# EAGLE design Carrier Board (EAGLE 8.2.2)

## Sheet 1 of 3: Sensors
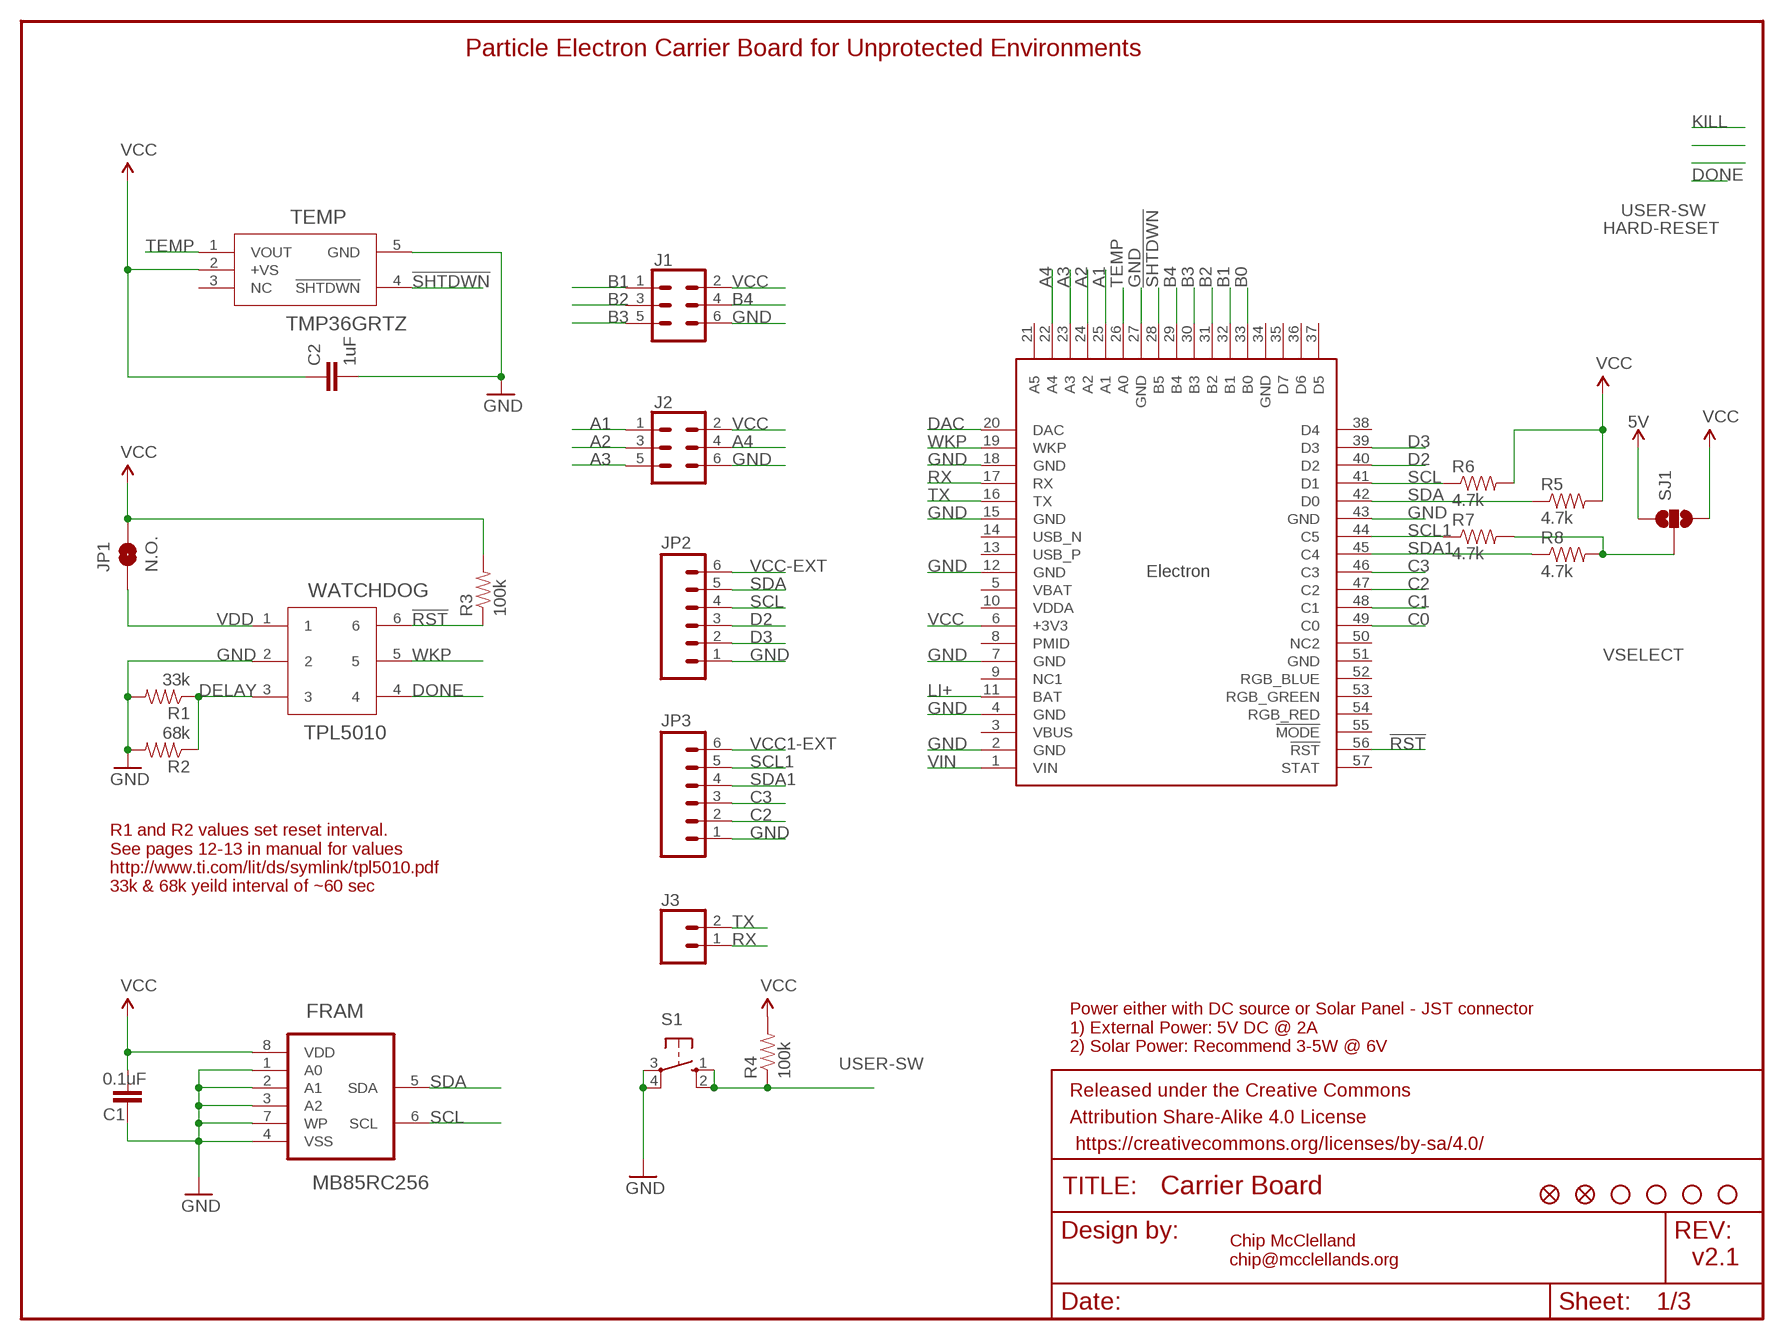
[diagram p0: schematic, sheet 1]

### Parts
C1  0.1uF  CAP0805  [0805]
C2  1uF  CAP0805  [0805]
FD1  FIDUCIALUFIDUCIAL  [FIDUCIAL-MICRO]
FD2  FIDUCIALUFIDUCIAL  [FIDUCIAL-MICRO]
FRAM  MB85RC256  MB85RC128PNF-G-JNE1  [SOIC127P600X175-8N]
FRAME1  FRAME-LETTER  [CREATIVE_COMMONS]
J1  CONN_03X22X3_SILK_MALE_PTH  [2X3]
J2  CONN_03X22X3_SILK_MALE_PTH  [2X3]
J3  CONN_02  [1X02]
JP1  N.O.  JUMPER-SMT_2_NO_SILK  [SMT-JUMPER_2_NO_SILK]
JP2  M06LOCK  [1X06_LOCK]
JP3  M06LOCK  [1X06_LOCK]
JP4  STAND-OFF  [STAND-OFF]
JP5  STAND-OFF  [STAND-OFF]
JP6  STAND-OFF  [STAND-OFF]
JP7  STAND-OFF  [STAND-OFF]
R1  33k  RESISTOR0805-RES  [0805]
R2  68k  RESISTOR0805-RES  [0805]
R3  100k  RESISTOR0805-RES  [0805]
R4  100k  RESISTOR0805-RES  [0805]
R5  4.7k  RESISTOR0805-RES  [0805]
R6  4.7k  RESISTOR0805-RES  [0805]
R7  4.7k  RESISTOR0805-RES  [0805]
R8  4.7k  RESISTOR0805-RES  [0805]
S1  10-XX  [B3F-10XX]
SJ1  SOLDERJUMPER_2WAYPASTE1&2  [SJ_3_PASTE1&2]
TEMP  TMP36GRTZ  TMP36GRTZ-REEL7  [RJ_5]
U$1  E0-NOT-OFFICIAL  [E0-NOT-OFFICIAL]
WATCHDOG  TPL5010  [TSOT-23]

### Nets
5V: SJ1.1 ; also sheet 3
!RST: R3.1 U$1.56(!RST) WATCHDOG.6
!SHTDWN: TEMP.4(!SHTDWN) U$1.28(B5)
A1: J2.1 U$1.25(A1)
A2: J2.3 U$1.24(A2)
A3: J2.5 U$1.23(A3)
A4: J2.4 U$1.22(A4)
B0: U$1.33(B0)
B1: J1.1 U$1.32(B1)
B2: J1.3 U$1.31(B2)
B3: J1.5 U$1.30(B3)
B4: J1.4 U$1.29(B4)
C0: U$1.49(C0)
C1: U$1.48(C1)
C2: JP3.2 U$1.47(C2) ; also sheet 3
C3: JP3.3 U$1.46(C3) ; also sheet 3
D2: JP2.3 U$1.40(D2) ; also sheet 3
D3: JP2.2 U$1.39(D3) ; also sheet 3
DAC: U$1.20(DAC)
DELAY: R1.1 R2.1 WATCHDOG.3
DONE: WATCHDOG.4
GND: C1.2 C2.2 FRAM.1(A0) FRAM.2(A1) FRAM.3(A2) FRAM.4(VSS) FRAM.7(WP) J1.6 J2.6 JP2.1 JP3.1 R1.2 R2.2 S1.3(P) S1.4(P1) TEMP.5(GND) U$1.7(GND) U$1.18(GND) U$1.27(GND) U$1.43(GND) WATCHDOG.2 ; also sheet 2,3
LI+: U$1.11(BAT) ; also sheet 2
RX: J3.1 U$1.17(RX)
SCL: FRAM.6(SCL) JP2.4 R6.1 U$1.41(D1) ; also sheet 3
SCL1: JP3.5 R7.1 U$1.44(C5) ; also sheet 3
SDA: FRAM.5(SDA) JP2.5 R5.1 U$1.42(D0) ; also sheet 3
SDA1: JP3.4 R8.1 U$1.45(C4) ; also sheet 3
TEMP: TEMP.1(VOUT) U$1.26(A0)
TX: J3.2 U$1.16(TX)
USER-SW: R4.1 S1.1(S) S1.2(S1)
VCC: C1.1 C2.1 FRAM.8(VDD) J1.2 J2.2 JP1.2 R3.2 R4.2 R5.2 R6.2 SJ1.3 TEMP.2(+VS) U$1.6(+3V3) ; also sheet 3
VCC1-EXT: JP3.6 ; also sheet 3
VCC-EXT: JP2.6 ; also sheet 3
VDD: JP1.1 WATCHDOG.1
VIN: U$1.1(VIN) ; also sheet 2
VSELECT: R7.2 R8.2 SJ1.2 ; also sheet 3
WKP: U$1.19(WKP) WATCHDOG.5
Unconnected: TEMP.3(NC) U$1.2(GND) U$1.3(VBUS) U$1.4(GND) U$1.5(VBAT) U$1.8(PMID) U$1.9(NC1) U$1.10(VDDA) U$1.12(GND) U$1.13(USB_P) U$1.14(USB_N) U$1.15(GND) U$1.21(A5) U$1.34(GND) U$1.35(D7) U$1.36(D6) U$1.37(D5) U$1.38(D4) U$1.50(NC2) U$1.51(GND) U$1.52(RGB_BLUE) U$1.53(RGB_GREEN) U$1.54(RGB_RED) U$1.55(!MODE) U$1.57(STAT)

### Notes on the sheet
- Particle Electron Carrier Board for Unprotected Environments
- R1 and R2 values set reset interval.
  See pages 12-13 in manual for values
  http://www.ti.com/lit/ds/symlink/tpl5010.pdf
  33k & 68k yeild interval of ~60 sec
- Power either with DC source or Solar Panel - JST connector
  1) External Power: 5V DC @ 2A 
  2) Solar Power: Recommend 3-5W @ 6V
- Chip McClelland
  chip@mcclellands.org
- v2.1

## Sheet 2 of 3: Power Control
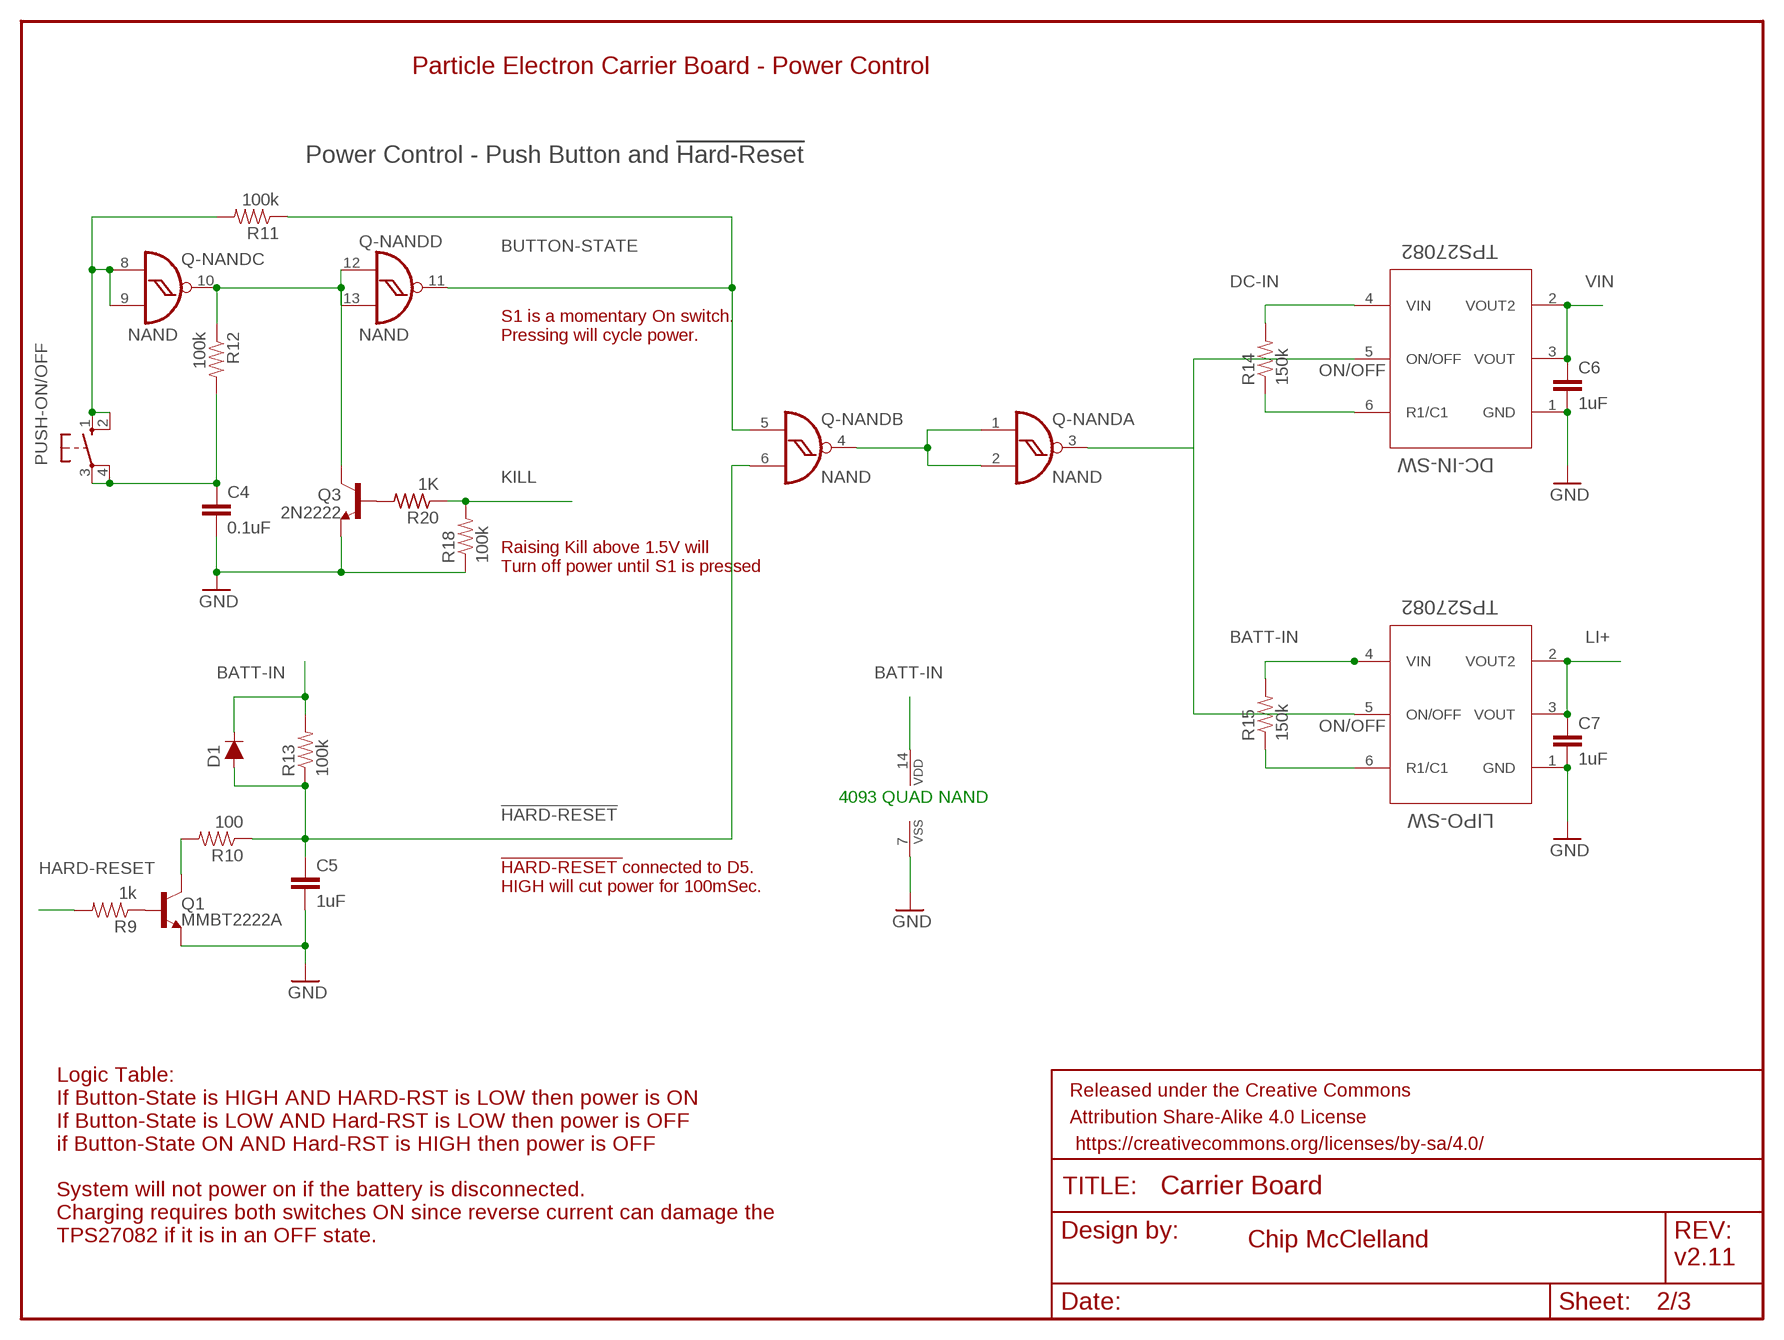
[diagram p1: schematic, sheet 2]

### Parts
C4  0.1uF  CAP0805  [0805]
C5  1uF  CAP0805  [0805]
C6  1uF  CAP0805  [0805]
C7  1uF  CAP0805  [0805]
D1  DIODE-BAS16J  [SOD-323]
DC-IN-SW  TPS27082  [TSOT-23]
FRAME2  FRAME-LETTER  [CREATIVE_COMMONS]
LIPO-SW  TPS27082  [TSOT-23]
PUSH-ON/OFF  40-XX-ROUND  [B3F-40XX-ROUND]
Q1  MMBT2222A  TRANS_NPN-MMBT2222AL  [SOT23-3]
Q3  2N2222  MMBT2222ALT1-NPN-SOT23-BEC  [SOT23-BEC]
Q-NAND  NAND  4093DT  [MC14093B-TSSOP14]
R9  1k  RESISTOR0805-RES  [0805]
R10  100  RESISTOR0805-RES  [0805]
R11  100k  RESISTOR0805-RES  [0805]
R12  100k  RESISTOR0805-RES  [0805]
R13  100k  RESISTOR0805-RES  [0805]
R14  150k  RESISTOR0805-RES  [0805]
R15  150k  RESISTOR0805-RES  [0805]
R18  100k  RESISTOR0805-RES  [0805]
R20  1K  R-US_R0805  [R0805]

### Nets
!HARD-RESET: C5.1 D1.A Q-NAND.6(B:I1) R10.1 R13.1
BATT-IN: D1.C LIPO-SW.4(VIN) Q-NAND.14(P:VDD) R13.2 R15.2 ; also sheet 3
BUTTON-STATE: Q-NAND.5(B:I0) Q-NAND.11(D:O) R11.1
DC-IN: DC-IN-SW.4(VIN) R14.2 ; also sheet 3
GND: C4.2 C5.2 C6.2 C7.2 DC-IN-SW.1(GND) LIPO-SW.1(GND) Q1.2(E) Q3.E Q-NAND.7(P:VSS) R18.1 ; also sheet 1,3
HARD-RESET: R9.2 ; also sheet 1
KILL: R18.2 R20.1 ; also sheet 1
LI+: C7.1 LIPO-SW.2(VOUT2) LIPO-SW.3(VOUT) ; also sheet 1
N$1: Q-NAND.1(A:I0) Q-NAND.2(A:I1) Q-NAND.4(B:O)
N$8: Q3.B R20.2
N$14: Q3.C Q-NAND.10(C:O) Q-NAND.12(D:I0) Q-NAND.13(D:I1) R12.1
N$15: DC-IN-SW.6(R1/C1) R14.1
N$16: Q1.1(B) R9.1
N$17: LIPO-SW.6(R1/C1) R15.1
N$19: Q1.3(C) R10.2
N$24: C4.1 PUSH-ON/OFF.3(P) PUSH-ON/OFF.4(P1) R12.2
N$25: PUSH-ON/OFF.1(S) PUSH-ON/OFF.2(S1) Q-NAND.8(C:I0) Q-NAND.9(C:I1) R11.2
ON/OFF: DC-IN-SW.5(ON/OFF) LIPO-SW.5(ON/OFF) Q-NAND.3(A:O)
VIN: C6.1 DC-IN-SW.2(VOUT2) DC-IN-SW.3(VOUT) ; also sheet 1

### Notes on the sheet
- Particle Electron Carrier Board - Power Control
- Power Control - Push Button and !Hard-Reset
- S1 is a momentary On switch.
  Pressing will cycle power.
- Raising Kill above 1.5V will
  Turn off power until S1 is pressed
- 4093 QUAD NAND
- !HARD-RESET !connected to D5. 
  HIGH will cut power for 100mSec.
- Chip McClelland
- Logic Table:
  If Button-State is HIGH AND HARD-RST is LOW then power is ON
  If Button-State is LOW AND Hard-RST is LOW then power is OFF
  if Button-State ON AND Hard-RST is HIGH then power is OFF
  
  System will not power on if the battery is disconnected.  
  Charging requires both switches ON since reverse current can damage the
  TPS27082 if it is in an OFF state.
- v2.11

## Sheet 3 of 3: Protection and 5V Boost
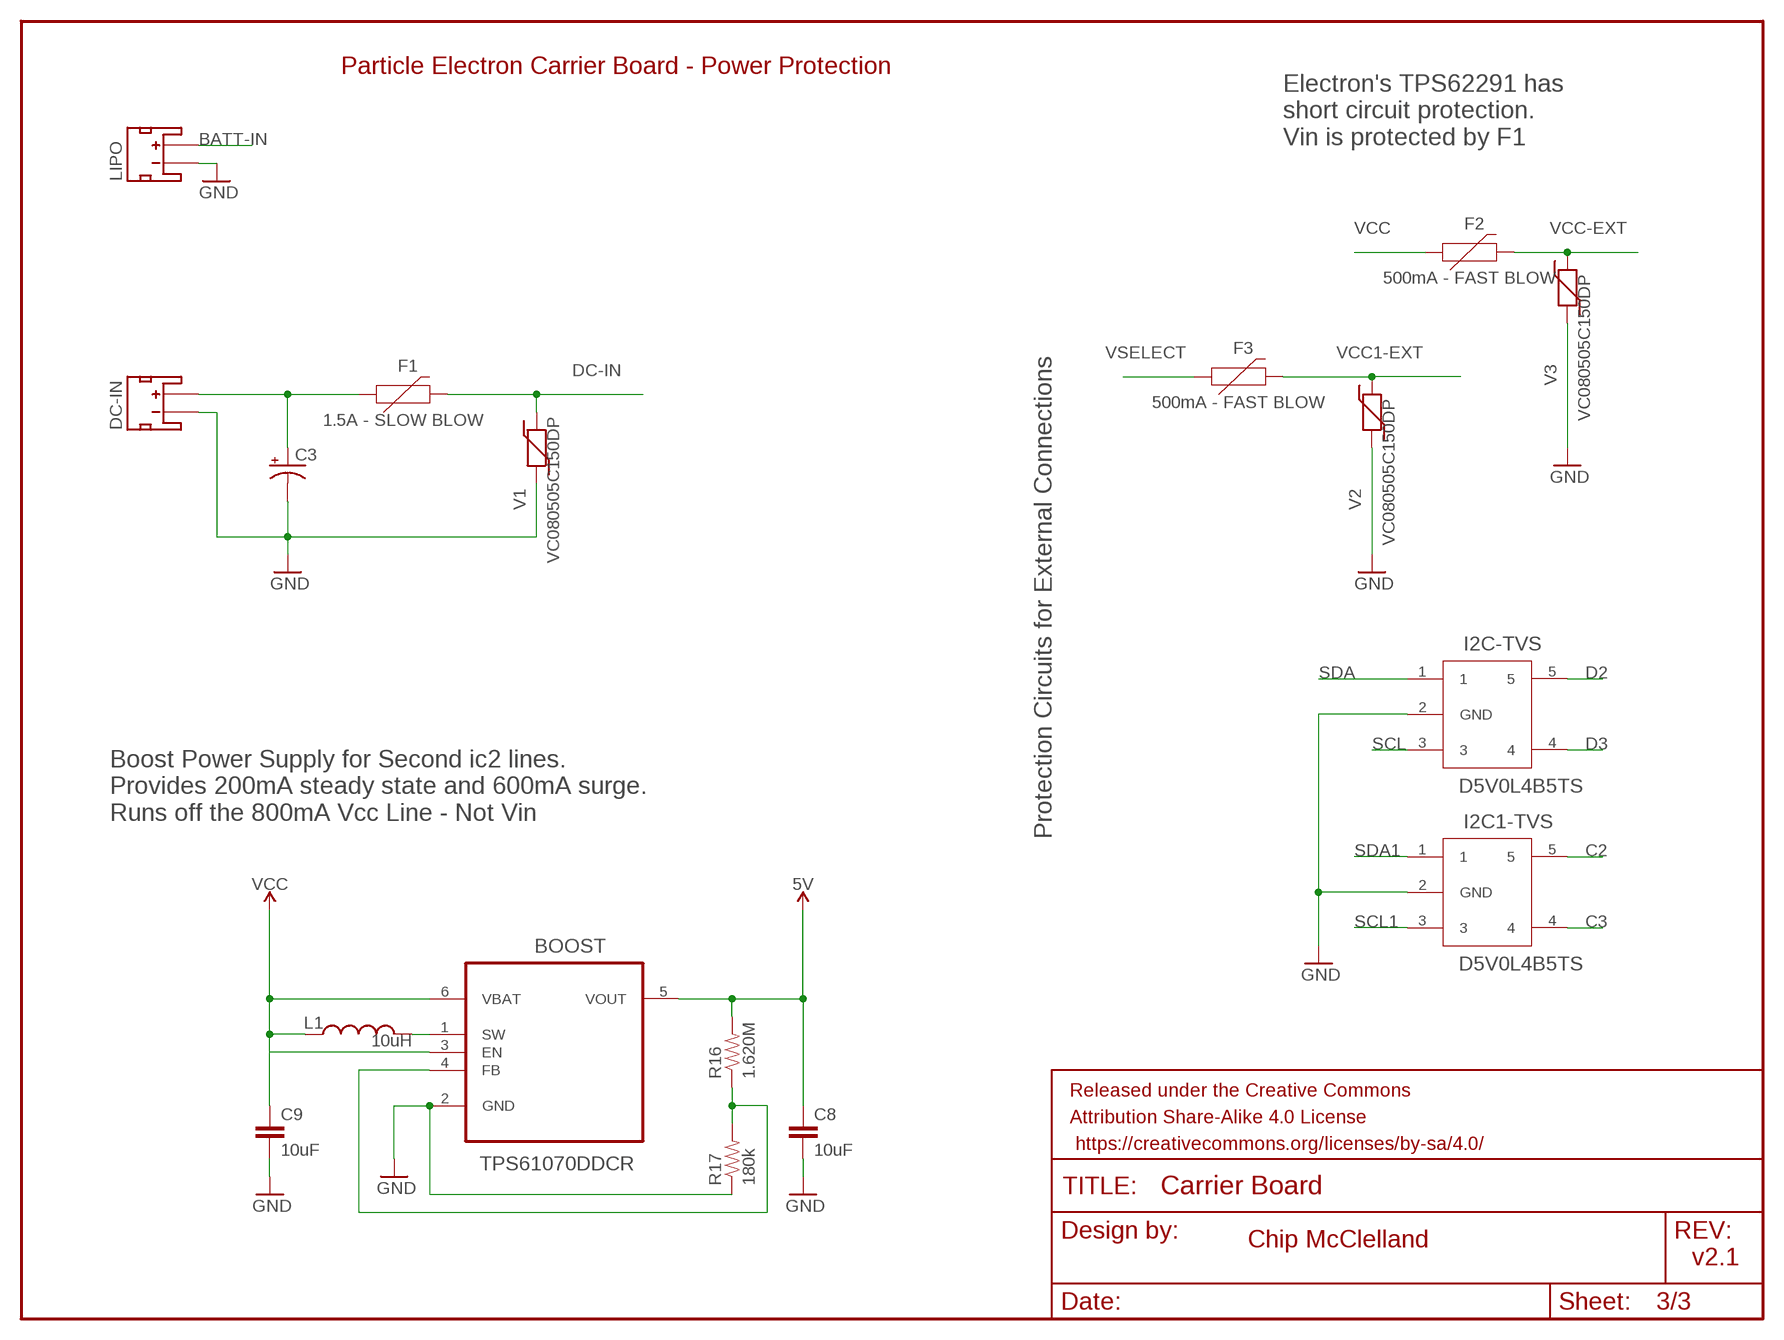
[diagram p2: schematic, sheet 3]

### Parts
BOOST  TPS61070DDCR  [SOT95P280X110-6N]
C3  CAP_POLG  [PANASONIC_G]
C8  10uF  CAP0805  [0805]
C9  10uF  CAP0805  [0805]
DC-IN  5V @ 2A  JST_2MM_MALE  [JST-2-SMD]
F1  1.5A - SLOW BLOW  PPTC_HALF-AMP  [1206]
F2  500mA - FAST BLOW  PPTC_HALF-AMP  [1206]
F3  500mA - FAST BLOW  PPTC_HALF-AMP  [1206]
FRAME3  FRAME-LETTER  [CREATIVE_COMMONS]
I2C1-TVS  D5V0L4B5TS  [SOT-23-5]
I2C-TVS  D5V0L4B5TS  [SOT-23-5]
L1  10uH  INDUCTORSDR0403-560KL  [SDR0403]
LIPO  JST_2MM_MALE  [JST-2-SMD]
R16  1.620M  RESISTOR0805-RES  [0805]
R17  180k  RESISTOR0805-RES  [0805]
V1  VC080505C150DP  VARISTOR  [0805]
V2  VC080505C150DP  VARISTOR  [0805]
V3  VC080505C150DP  VARISTOR  [0805]

### Nets
5V: BOOST.5(VOUT) C8.1 R16.2 ; also sheet 1
BATT-IN: LIPO.2(+) ; also sheet 2
C2: I2C1-TVS.5 ; also sheet 1
C3: I2C1-TVS.4 ; also sheet 1
D2: I2C-TVS.5 ; also sheet 1
D3: I2C-TVS.4 ; also sheet 1
DC-IN: C3.+ DC-IN.2(+) F1.1 F1.2 V1.2 ; also sheet 2
GND: BOOST.2(GND) C3.- C8.2 C9.2 DC-IN.1(-) I2C1-TVS.2(GND) I2C-TVS.2(GND) LIPO.1(-) R17.1 V1.1 V2.1 V3.1 ; also sheet 1,2
N$2: BOOST.4(FB) R16.1 R17.2
SCL: I2C-TVS.3 ; also sheet 1
SCL1: I2C1-TVS.3 ; also sheet 1
SDA: I2C-TVS.1 ; also sheet 1
SDA1: I2C1-TVS.1 ; also sheet 1
SW: BOOST.1(SW) L1.P$2
VCC: BOOST.3(EN) BOOST.6(VBAT) C9.1 F2.1 L1.P$1 ; also sheet 1
VCC1-EXT: F3.2 V2.2 ; also sheet 1
VCC-EXT: F2.2 V3.2 ; also sheet 1
VSELECT: F3.1 ; also sheet 1
Unconnected: DC-IN.NC1(PAD1) DC-IN.NC2(PAD2) LIPO.NC1(PAD1) LIPO.NC2(PAD2)

### Notes on the sheet
- Particle Electron Carrier Board - Power Protection
- Electron's TPS62291 has 
  short circuit protection. 
  Vin is protected by F1
- Boost Power Supply for Second ic2 lines.
  Provides 200mA steady state and 600mA surge. 
  Runs off the 800mA Vcc Line - Not Vin
- Protection Circuits for External Connections
- Chip McClelland
- v2.1

## Library data of the parts
BOOST = Texas Instruments_By_element14_Batch_1:TPS61070DDCR: SYNCHRONOUS BOOST CONVERTER; MPN: TPS61070DDCR; OC_FARNELL: 1461062; OC_NEWARK: 64M3125; PACKAGE: SOT-23-6; SUPPLIER: Texas Instruments
C1 C2 C4-C9 = SparkFun-Capacitors:CAP: Capacitor Standard 0603 ceramic capacitor, and 0.1" leaded capacitor.
C3 = SparkFun-Capacitors:CAP_POL: Capacitor Polarized These are standard SMD and PTH capacitors. Normally 10uF, 47uF, and 100uF in electrolytic and tantalum varieties. Always verify the external diameter of the through hole cap, it varies with capacity, voltage, and manufacturer. The EIA devices should be standard.
D1 = SparkFun-DiscreteSemi:DIODE: Diode These are standard reverse protection diodes and small signal diodes. SparkFun Products: SparkFun SparkPunk Sound Kit <https://www.sparkfun.com/products/11177> SparkFun ESP8266 Thing <https://www.sparkfun.com/products/13231>; PROD_ID: DIO-09646; VALUE: 250mA/100V
DC-IN LIPO = SparkFun-Connectors:JST_2MM_MALE: JST 2MM MALE RA CONNECTOR Two pin, compact surface mount connector. Commonly used as a battery input connection point. We really like the solid locking feeling and high current rating on these small connectors. We use these all the time as battery connectors. Mates to single-cell LiPo batteries. Here is the connector we sell at SparkFun: JST Right Angle Connector - White <https://www.sparkfun.com/products/8612> (PRT-08612) Datasheet <http://www.sparkfun.com/datasheets/Prototyping/Connectors/JST-Horizontal.pdf> It was used on these SparkFun products: SparkFun MOSFET Power Controller <https://www.sparkfun.com/products/11214> (PRT-11214) SparkFun Battery Babysitter - LiPo Battery Manager <https://www.sparkfun.com/products/13777> (PRT-13777) And many, many others that required a lipo battery connection.; PROD_ID: CONN-11443; SF_ID: PRT-08612
DC-IN-SW LIPO-SW = Custom Components:TPS27082: TI TPS27082 Single High-Side On-Off Switch
F1-F3 = SparkFun-Fuses:PPTC: Resettable Fuse PPTC Resettable Fuse. Really a sort of resistor with a polymeric positive temperature coefficient whose resistance increases dramatically with an increase in temperature. When heated by the power passing through the resistance rises causing the current to be limited, protecting the circuit. This is achieved by the transition of the polymer from a crystalline to an amorphous state where the conductive carbon separates breaking the conductive pathways found in the cool crystalline structure. When a PPTC cools back down it resumes conducting letting the circuit turn back on. SparkFun Products: SparkFun RedBoard - Programmed with Arduino <https://www.sparkfun.com/products/12757> Pro Micro - 5V/16MHz <https://www.sparkfun.com/products/12640> Arduino Pro 328 - 5V/16MHz <https://www.sparkfun.com/products/10915> MP3 Trigger <https://www.sparkfun.com/products/13720>; PROD_ID: RES-08585; VALUE: 6V/0.5A
FD1 FD2 = SparkFun-Aesthetics:FIDUCIAL: Fiducial Alignment Points Point-of-reference for pick-and-place machines and other optical instruments.
FRAM = Fujitsu_By_element14_Batch_1:MB85RC128PNF-G-JNE1: Memory FRAM; MPN: MB85RC128PNF-G-JNE1; OC_FARNELL: 1831995; OC_NEWARK: 93R5161; PACKAGE: SO-8; SUPPLIER: FUJITSU
FRAME1-FRAME3 = SparkFun-Aesthetics:FRAME-LETTER: Schematic Frame - Letter Standard 8.5x11 US Letter frame
I2C1-TVS I2C-TVS = Custom Components:D5V0L4B5TS: 4 CHANNEL LOW CAPACITANCE BI-DIRECTIONAL TVS ARRAY
J1 J2 = SparkFun-Connectors:CONN_03X2: Multi connection point. Often used as Generic Header-pin footprint for 0.1 inch spaced/style header connections You can populate with any combo of single row headers, but if you'd like an exact match, check these: Header - 2x3 (Male, 0.1") <https://www.sparkfun.com/products/12807> (PRT-12807) Header - 2x3 (Female, 0.1") <https://www.sparkfun.com/products/13010> (PRT-13010) 2x3 Pin Shrouded Header <https://www.sparkfun.com/products/10877> (PRT-10877) On any of the 0.1 inch spaced packages, you can populate with these: Break Away Headers - Straight <https://www.sparkfun.com/products/116> (PRT-00116) Break Away Male Headers - Right Angle <https://www.sparkfun.com/products/553> (PRT-00553) Female Headers <https://www.sparkfun.com/products/115> (PRT-00115) Break Away Headers - Machine Pin <https://www.sparkfun.com/products/117> (PRT-00117) Break Away Female Headers - Swiss Machine Pin <https://www.sparkfun.com/products/743> (PRT-00743) Special note: the shrouded connector mates well with our 3x2 ribbon cables: Ribbon Crimp Connector - 6-pin (2x3, Female) <https://www.sparkfun.com/products/10651> (PRT-10651) Ribbon Cable - 6 wire (15ft) <https://www.sparkfun.com/products/10646> (PRT-10646); PROD_ID: CONN-09701
J3 = SparkFun-Connectors:CONN_02: Multi connection point. Often used as Generic Header-pin footprint for 0.1 inch spaced/style header connections On any of the 0.1 inch spaced packages, you can populate with these: Break Away Headers - Straight <https://www.sparkfun.com/products/116> (PRT-00116) Break Away Male Headers - Right Angle <https://www.sparkfun.com/products/553> (PRT-00553) Female Headers <https://www.sparkfun.com/products/115> (PRT-00115) Break Away Headers - Machine Pin <https://www.sparkfun.com/products/117> (PRT-00117) Break Away Female Headers - Swiss Machine Pin <https://www.sparkfun.com/products/743> (PRT-00743) For SCREWTERMINALS and SPRING TERMINALS visit here: Screw Terimnals on SparkFun.com <https://www.sparkfun.com/search/results?term=Screw+Terminals> (5mm/3.5mm/2.54mm spacing) This device is also useful as a general connection point to wire up your design to another part of your project. Our various solder wires solder well into these plated through hole pads. Hook-Up Wire - Assortment (Stranded, 22 AWG) <https://www.sparkfun.com/products/11375> (PRT-11375) Hook-Up Wire - Assortment (Solid Core, 22 AWG) <https://www.sparkfun.com/products/11367> (PRT-11367) View the entire wire category on our website here <https://www.sparkfun.com/categories/141> Special notes: Molex polarized connector foot print use with: PRT-08233 with associated crimp pins and housings. 2.54_SCREWTERM for use with PRT-10571. 3.5mm Screw Terminal footprints for PRT-08084 5mm Screw Terminal footprints for use with PRT-08432
JP1 = SparkFun-Jumpers:JUMPER-SMT_2_NO: Normally open jumper This jumper has two pads in close proximity to each other. Apply solder to close the connection. Round pads are easier to solder for beginners, but are a lot larger. SparkFun Product that uses the round pads: SparkFun EL Sequencer <https://www.sparkfun.com/products/12781>
JP2 JP3 = SparkFun-Connectors:M06: Header 6 Standard 6-pin 0.1" header. Use with straight break away headers (SKU : PRT-00116), right angle break away headers (PRT-00553), swiss pins (PRT-00743), machine pins (PRT-00117), and female headers (PRT-00115). Molex polarized connector foot print use with SKU : PRT-08094 with associated crimp pins and housings. NOTES ON THE VARIANTS LOCK and LOCK_LONGPADS... This footprint was designed to help hold the alignment of a through-hole component (i.e. 6-pin header) while soldering it into place. You may notice that each hole has been shifted either up or down by 0.005 of an inch from it's more standard position (which is a perfectly straight line). This slight alteration caused the pins (the squares in the middle) to touch the edges of the holes. Because they are alternating, it causes a "brace" to hold the component in place. 0.005 has proven to be the perfect amount of "off-center" position when using our standard breakaway headers. Although looks a little odd when you look at the bare footprint, once you have a header in there, the alteration is very hard to notice. Also,if you push a header all the way into place, it is covered up entirely on the bottom side. This idea of altering the position of holes to aid alignment will be further integrated into the Sparkfun Library for other footprints. It can help hold any component with 3 or more connection pins.
JP4-JP7 = SparkFun:STAND-OFF: Stand Off This is the mechanical footprint for a #4 phillips button head screw. Use the keepout ring to avoid running the screw head into surrounding components. SKU : PRT-00447
L1 = SparkFun-Passives:INDUCTOR: Inductors Basic Inductor/Choke - 0603 and 1206. Footprints are not proven and vary greatly between part numbers. SRN6045- 33uH, 20% 1.4A SDR0403-560KL - 56uH, 10%, 500mA RMS/740mA peak; DIST: DIGIKEY; DIST_ID: SDR0403-560KLCT-ND; VALUE: 56uH
PUSH-ON/OFF = adafruit:40-XX: OMRON SWITCH
Q1 = SparkFun-DiscreteSemi:TRANS_NPN: NPN transistor Current controlled devices typically used to amplify current or used as a switch. BC547 - COM-08928 <http://www.sparkfun.com/products/8928> (TO-92 45V 100mA) (1.Collector 2.Base 3.Emitter) 2N3904 - COM-00521 <http://www.sparkfun.com/products/521> (TO-92 40V 200mA) (1.Emitter 2.Base 3.Collector) P2N2222A - COM-12852 <http://www.sparkfun.com/products/12852> (TO-92 40V 600mA) (1.Collector 2.Base 3.Emitter); PROD_ID: TRANS-08049; VALUE: 600mA/40V
Q3 = transistor:*-NPN-: NPN Transistror BF959 corrected 2008.03.06
Q-NAND = adafruit:4093: Quad 2-input NAND schmitt trigger
R1-R18 = SparkFun-Passives:RESISTOR: Resistor Basic schematic elements and footprints for 0603, 1206, and PTH resistors.
R20 = adafruit:R-US_: RESISTOR, American symbol
S1 = switch-omron:10-XX: OMRON SWITCH
SJ1 = SparkFun-Passives:SOLDERJUMPER_2WAY: Solder Jumper 2 way solder jumper
TEMP = TMP36:TMP36GRTZ-REEL7; MANUFACTURER_PART_NUMBER: TMP36GRTZREEL7; VENDOR: Analog Devices Inc
U$1 = Particle-Devices:E0-NOT-OFFICIAL: Particle E0 - Based on v005 Pinout - Not Official - Dev Use Only
V1-V3 = Custom Components:VARISTOR
WATCHDOG = Custom Components:TPL5010

## Net classes
0 default: width 0.203 mm, drill 0.33 mm

## Board
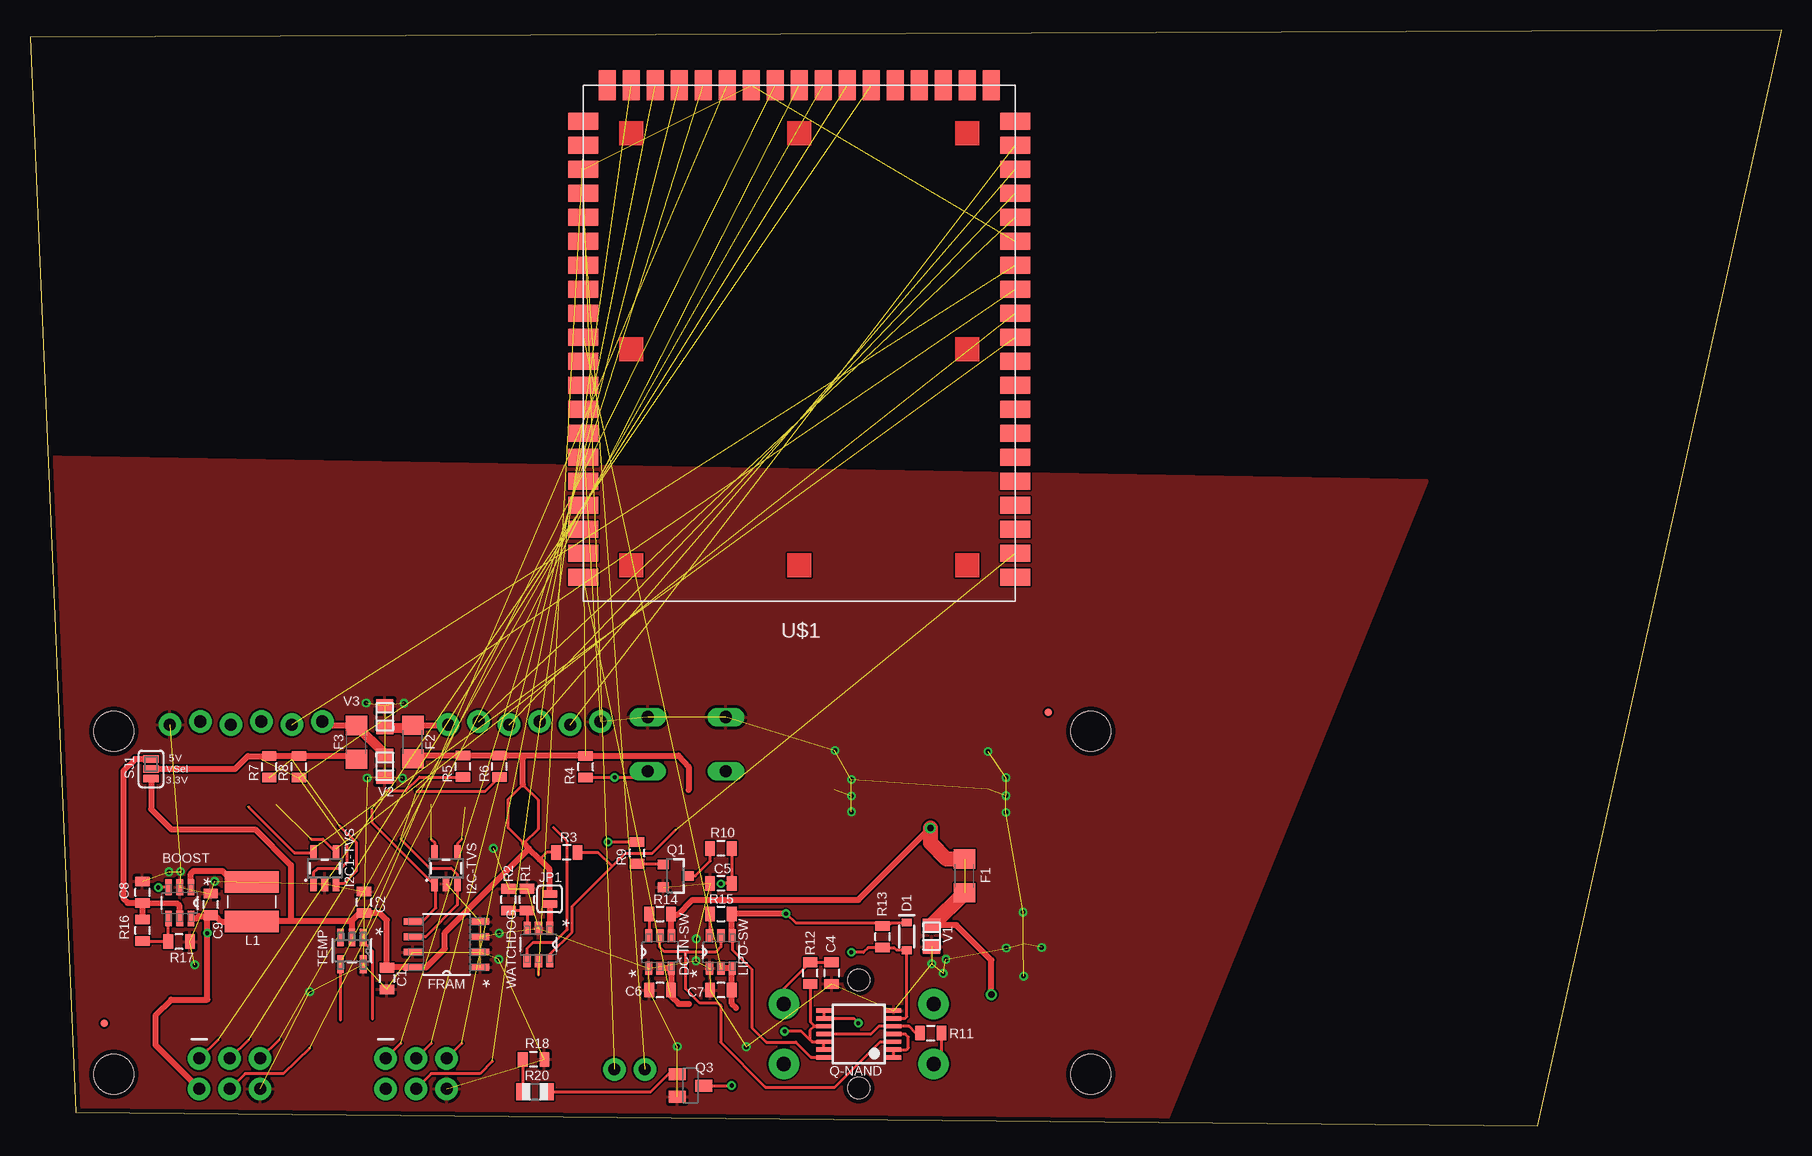
[diagram p3: board, top side]
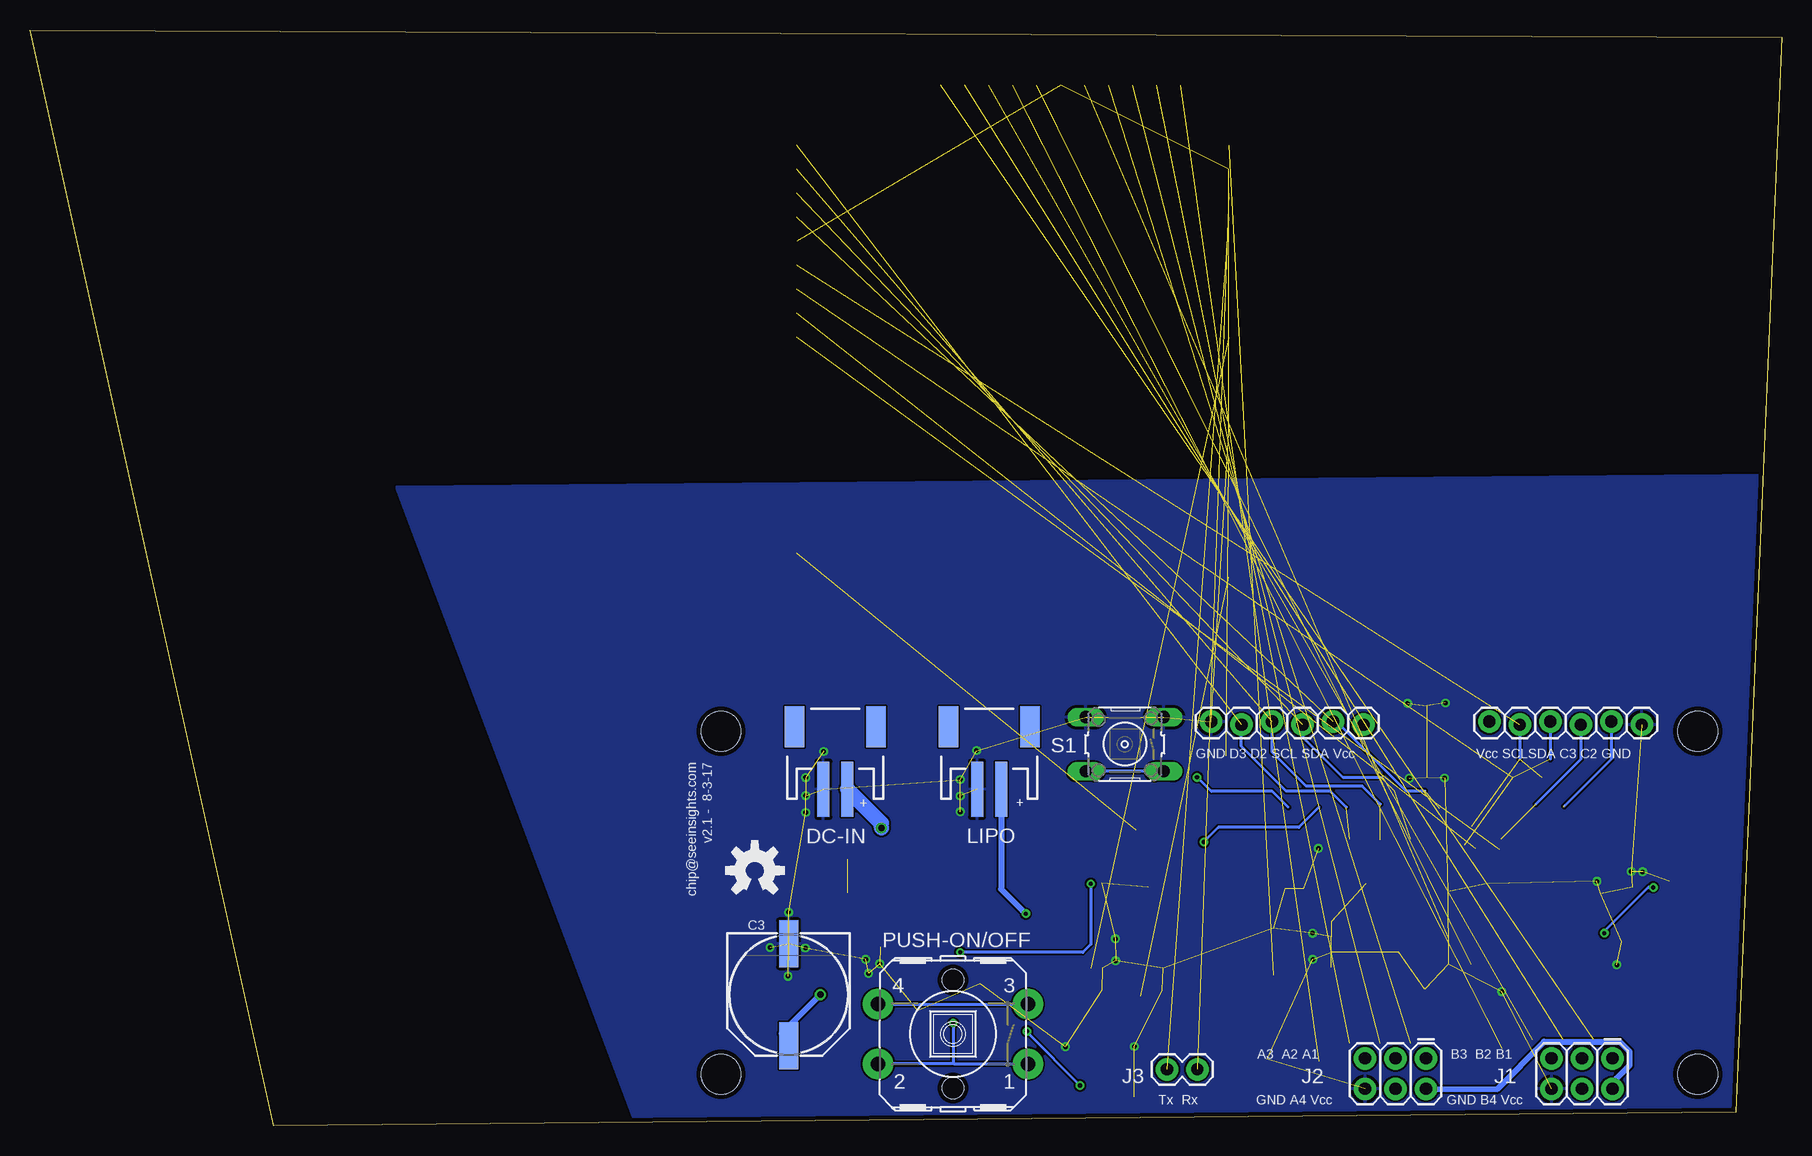
[diagram p4: board, bottom side, seen from below]

Size 145.97 x 91.31 mm. Coordinates in mm from the lower left corner, seen from the top.
Outline: 3.81,1.12 125.65,0 145.97,91.31 0,90.7 3.81,1.12
Copper layers (1*16): Top 0.0356mm / dielectric 1.5011mm / Bottom 0.0356mm
Design rules "LaenPCBOrder": minimum track width 6mil, minimum drill 13mil, track to track 6mil, track to pad 6mil, pad to pad 6mil, via to via 6mil, smd to smd 6mil, copper to edge 15mil, drill to drill 6mil, minimum pad ring 7mil, minimum via ring 7mil, stop-mask expansion 3mil, vias tented up to drill 0mil, thermal gap 10mil

### Footprints (pad centres in the part's own frame; a part is rotated, then mirrored left to right if it is on the bottom)
SOT95P280X110-6N = smd 1.321 x 0.559: 1 -1.295,0.94; 2 -1.295,0; 3 -1.295,-0.94; 4 1.295,-0.94; 5 1.295,0; 6 1.295,0.94
0805 = smd 0.8 x 1.2: 1 -0.9,0; 2 0.9,0
PANASONIC_G = smd 3.9 x 1.6: + 4.25,0; - -4.25,0
SOD-323 = smd 0.63 x 0.83: A 1.15,0; C -1.15,0
JST-2-SMD = smd 1 x 4.6: 1 -1,-3.7; 2 1,-3.7 | smd 1.6 x 3.4: NC1 -3.4,1.5; NC2 3.4,1.5
TSOT-23 = smd 1.1 x 0.6: 1 -1.35,0.95; 2 -1.35,0; 3 -1.35,-0.94; 4 1.35,-0.95; 5 1.35,0; 6 1.35,0.95
1206 = smd 1.6 x 1.8: 1 -1.4,0; 2 1.4,0
FIDUCIAL-MICRO = smd 0.635 x 0.635: 1 0,0
SOIC127P600X175-8N = smd 1.473 x 0.559: 1 -2.819,1.905; 2 -2.819,0.635; 3 -2.819,-0.635; 4 -2.819,-1.905; 5 2.819,-1.905; 6 2.819,-0.635; 7 2.819,0.635; 8 2.819,1.905
SOT-23-5 = smd 0.55 x 1.2: 1 -0.95,-1.3; 2 0,-1.3; 3 0.95,-1.3; 4 0.95,1.3; 5 -0.95,1.3
2X3 = drill 1.016 pad 1.88: 1 0,0; 2 0,2.54; 3 2.54,0; 4 2.54,2.54; 5 5.08,0; 6 5.08,2.54
1X02 = drill 1.016 pad 1.88: 1 0,0; 2 2.54,0
SMT-JUMPER_2_NO_SILK = smd 0.635 x 1.27: 1 -0.406,0; 2 0.406,0
1X06_LOCK = drill 1.016 pad 1.88: 1 0,0; 2 2.54,-0.254; 3 5.08,0; 4 7.62,-0.254; 5 10.16,0; 6 12.7,-0.254
STAND-OFF = hole 3.302: 0,0
SDR0403 = smd 1.8 x 4.5: P$1 -1.65,0; P$2 1.65,0
B3F-40XX-ROUND = drill 1.194 pad 2.54: 1 -6.248,2.489; 2 6.248,2.489; 3 -6.248,-2.489; 4 6.248,-2.489 | hole 1.803: 0,-4.496; 0,4.496
SOT23-3 = smd 0.8 x 0.9: 1 -0.95,-1; 2 0.95,-1; 3 0,1.1
SOT23-BEC = smd 1 x 1.4: B -0.95,-1.1; C 0,1.1; E 0.95,-1.1
MC14093B-TSSOP14 = smd 0.36 x 1.26: 1 -1.95,-2.925; 2 -1.3,-2.925; 3 -0.65,-2.925; 4 0,-2.925; 5 0.65,-2.925; 6 1.3,-2.925; 7 1.95,-2.925; 8 1.95,2.925; 9 1.3,2.925; 10 0.65,2.925; 11 0,2.925; 12 -0.65,2.925; 13 -1.3,2.925; 14 -1.95,2.925
R0805 = smd 1.1 x 1.4: 1 -1,0; 2 1,0
B3F-10XX = drill 1.016 long: 1 -3.251,2.261; 2 3.251,2.261; 3 -3.251,-2.261; 4 3.251,-2.261
SJ_3_PASTE1&2 = smd 0.635 x 1.27: 1 -0.813,0; 2 0,0; 3 0.813,0
RJ_5 = smd 1.473 x 0.559: 1 -1.118,0.95; 2 -1.118,0; 3 -1.118,-0.95; 4 1.118,-0.95; 5 1.118,0.95
E0-NOT-OFFICIAL = smd 2.5 x 1.4: 1 0,2; 2 0,4; 3 0,6; 4 0,8; 5 0,10; 6 0,12; 7 0,14; 8 0,16; 9 0,18; 10 0,20; 11 0,22; 12 0,24; 13 0,26; 14 0,28; 15 0,30; 16 0,32; 17 0,34; 18 0,36; 19 0,38; 20 0,40; 38 36,40; 39 36,38; 40 36,36; 41 36,34; 42 36,32; 43 36,30; 44 36,28; 45 36,26; 46 36,24; 47 36,22; 48 36,20; 49 36,18; 50 36,16; 51 36,14; 52 36,12; 53 36,10; 54 36,8; 55 36,6; 56 36,4; 57 36,2 | smd 1.4 x 2.5: 21 2,43; 22 4,43; 23 6,43; 24 8,43; 25 10,43; 26 12,43; 27 14,43; 28 16,43; 29 18,43; 30 20,43; 31 22,43; 32 24,43; 33 26,43; 34 28,43; 35 30,43; 36 32,43; 37 34,43
0805' = smd 1.118 x 1.448: 1 -0.902,0; 2 0.902,0

### Placement (x,y rotation side)
BOOST  12.47,18.57 270 top
C1  29.74,12.27 270 top
C2  27.84,18.62 90 top
C3  82.75,10.92 270 bottom
C4  66.8,12.73 270 top
C5  57.58,20.19 180 top
C6  52.5,11.3 180 top
C7  57.58,11.3 180 top
C8  9.37,19.46 90 top
C9  15.06,18.44 90 top
D1  73.08,15.77 270 top
DC-IN  78.87,31.75 0 bottom
DC-IN-SW  52.5,14.48 90 top
F1  77.88,20.83 90 top
F2  31.9,31.98 90 top
F3  27.2,31.95 90 top
FD1  84.84,34.47 0 top
FD2  6.17,8.53 0 top
FRAM  34.72,15.11 180 top
FRAME1  3.84,-10.69 0 top  (outside the outline)
FRAME2  3.84,-19.18 0 top  (outside the outline)
FRAME3  3.84,-27.66 0 top  (outside the outline)
I2C1-TVS  24.56,21.46 0 top
I2C-TVS  34.67,21.46 0 top
J1  14.1,5.61 180 bottom
J2  29.64,5.61 180 bottom
J3  48.69,4.7 180 bottom
JP1  43.31,18.9 90 top
JP2  47.55,33.68 0 bottom
JP3  11.66,33.43 180 bottom
JP4  88.39,32.87 0 top
JP5  88.39,4.29 90 top
JP6  6.98,32.87 0 top
JP7  6.98,4.29 0 top
L1  18.47,18.67 90 top
LIPO  66.04,31.75 0 bottom
LIPO-SW  57.58,14.48 90 top
PUSH-ON/OFF  69.06,7.65 180 bottom
Q1  53.77,20.83 270 top
Q3  55.04,3.35 270 top
Q-NAND  69.06,7.65 90 top
R1  41.43,18.85 90 top
R2  39.88,18.85 90 top
R3  44.73,22.78 180 top
R4  46.3,29.92 90 top
R5  36.07,29.95 90 top
R6  39.12,29.95 90 top
R7  19.94,29.92 90 top
R8  22.4,29.92 90 top
R9  50.6,22.73 90 top
R10  57.58,23.11 180 top
R11  75.06,7.72 0 top
R12  65.02,12.73 90 top
R13  71.04,15.75 90 top
R14  52.5,17.65 0 top
R15  57.58,17.65 0 top
R16  9.37,16.28 90 top
R17  12.42,15.34 180 top
R18  41.96,5.54 180 top
R20  42.09,2.84 0 top
S1  54.74,31.8 180 bottom
SJ1  10.08,29.74 270 top
TEMP  26.82,14.58 270 top
U$1  46.09,43.7 0 top
U$2  [OSHW-LOGO-M]  85.57,21.26 0 bottom
V1  VC080505C150DP  [0805']  75.13,15.8 90 top
V2  VC080505C150DP  [0805']  29.57,29.95 90 top
V3  VC080505C150DP  [0805']  29.57,34.09 270 top
WATCHDOG  42.37,15.11 270 top

### Tracks (layer width: path | path; a pad name or v marks a point on that pad's centre or on a via)
5V
  Top 0.508: BOOST.5 12.47,18.31 12.24,18.54 9.38,18.57 | 9.38,18.57 C8.1 R16.2 | SJ1.1 8.76,30.56 7.77,29.57 7.77,18.92 8.13,18.57 9.36,18.59 9.38,18.57
!HARD-RESET  (via drill 0.33)
  Top 0.254: R10.1 C5.1 57.58,20.19 v57.58,20.17 | v68.45,14.45 69.44,14.45 69.84,14.85 R13.1 | 71.03,14.83 R13.1 | R13.1 72.02,14.85 72.24,14.63 D1.A 73.08,9.09 72.93,8.95 Q-NAND.6
  Bottom 0.254: v57.58,20.17 57.58,15.12 58.24,14.45 v68.45,14.45
!RST  (1 unrouted)
  Top 0.254: 53.77,24.64 51.84,22.71 49.61,22.71 48.51,21.61 | WATCHDOG.6 43.32,14.27 45.19,16.14 45.19,18.29 48.51,21.61 | R3.1 47.33,22.78 48.51,21.61
!SHTDWN  (1 unrouted)
  Top 0.254: TEMP.4 25.87,8.8
A1  (1 unrouted)
  Top 0.254: 30.91,6.86 J2.1
A2  (1 unrouted)
  Top 0.254: 33.45,6.86 J2.3
A3  (1 unrouted)
  Top 0.254: 35.99,6.86 J2.5
A4  (1 unrouted)
  Top 0.254: 38.53,5.36 37.52,4.34 33.43,4.34 J2.4
B1  (1 unrouted)
  Top 0.254: 15.67,7.16 J1.1
B2  (1 unrouted)
  Top 0.254: 18.21,7.16 J1.3
B3  (1 unrouted)
  Top 0.254: 20.75,7.16 J1.5
B4  (1 unrouted)
  Top 0.254: 23.29,6.48 21.11,4.34 17.93,4.34 J1.4
BATT-IN  (via drill 0.35)
  Top 0.254: LIPO-SW.4 58.47,15.9 | 63.02,17.65 63.8,16.92 70.77,16.92 R13.2 71.54,16.65 71.81,16.92 73.07,16.92 D1.C | 58.48,15.88 58.55,15.81 58.55,14.63 60.15,13.03 60.15,8.18 61.37,6.96 63.83,6.96 65.08,5.71 66.12,5.71 Q-NAND.14
  Top 0.508: LIPO-SW.4 58.48,15.88 R15.2 63.02,17.65 v62.99,17.68
  Bottom 0.508: LIPO.2 65.04,19.73 v62.99,17.68
BUTTON-STATE
  Top 0.254: Q-NAND.11 70.08,7.65 70.71,8.28 71.97,8.28 | 71.97,8.28 Q-NAND.5 | R11.1 73.81,7.72 73.25,8.28 71.97,8.28
C2  (2 unrouted)
  Top 0.254: 23.49,22.99 I2C1-TVS.5 22.02,22.76 18.24,26.54
  Bottom 0.254: 16.94,27.81 18.11,26.64 14.2,30.56 JP3.2
C3  (2 unrouted)
  Top 0.254: 25.51,23.08 I2C1-TVS.4 24.4,23.88 23.42,23.88
  Bottom 0.254: 19.51,27.79 20.49,26.81 16.74,30.56 JP3.3
D2  (2 unrouted)
  Top 0.254: 33.45,23.85 33.73,23.57 I2C-TVS.5
  Bottom 0.254: JP2.3 42.47,31.14 39.62,28.3 34.95,28.3 33.45,26.8
D3  (2 unrouted)
  Top 0.254: 35.99,23.88 35.61,23.49 I2C-TVS.4
  Bottom 0.254: 36.27,26.54 37.62,27.89 41.3,27.89 45.03,31.62 45.03,33.4 JP2.2
DC-IN  (via drill 0.55)  (1 unrouted)
  Top 0.254: 53.44,15.9 DC-IN-SW.4 | 53.44,17.5 R14.2
  Top 0.508: DC-IN-SW.4 53.45,17.6 | 53.45,17.6 R14.2 | v80.11,10.92 80.11,13.79 77.19,16.71 75.15,16.71 V1.2 | 53.45,17.6 53.98,17.6 55.19,18.82 69.04,18.82 v75.03,24.82
  Top 1.27: F1.2 76.38,22.23 75.03,23.57 v75.03,24.82 | F1.1 75.16,16.72 V1.2
  Bottom 0.508: C3.+ 83.34,7.7 v80.11,10.92
  Bottom 1.27: v75.03,24.82 75.03,25.21 DC-IN.2
DELAY
  Top 0.254: WATCHDOG.3 R1.1 R2.1
DONE
  Top 0.254: 43.61,24.87 44.73,23.75 44.73,16.33 43.64,15.24 41.89,15.24 41.4,14.76 41.4,13.78 WATCHDOG.4
GND  (via drill 0.38)  (73 unrouted)
  other vias: 23.32,11.18 39.09,16.05 39.07,13.87 55.5,13.74 68.45,28.85 67.08,31.27 68.45,27.48 68.45,26.16 79.83,31.19 81.33,29.01 81.33,27.51 81.33,26.11 38.61,23.11 59.69,6.58 82.75,17.81 82.8,12.47 84.3,14.86 81.36,14.81 55.52,15.57 31.17,35.2 28.09,28.98 31.04,28.96 76.33,13.87 75.16,13.49 76.1,12.7 53.95,6.6 15.39,20.37 13.74,13.41 12.55,21.18 11.58,21.16 28.02,35.23
  pour Top (rank 2): -2.18,55.83 116.43,53.77 94.18,-0.89 0.03,-1.07
  pour Bottom: 0.15,54.23 115.44,53.21 94.95,-1.3 -0.41,-1.27
HARD-RESET  (via drill 0.35)
  Top 0.254: v48.16,23.65 50.58,23.65 R9.2
  Bottom 0.254: 38.56,26.54 40.23,24.87 46.94,24.87 v48.16,23.65
KILL
  Top 0.254: 41.07,2.86 R20.1 41.06,2.87 R18.2
LI+  (1 unrouted)
  Top 0.254: LIPO-SW.2 57.79,13.16 | 58.47,13.16 LIPO-SW.3 58.47,12.93 | 58.47,11.33 C7.1
  Top 0.508: 58.85,9.83 58.5,10.19 58.5,11.3 58.47,11.33 | C7.1 58.48,13.09 LIPO-SW.3 LIPO-SW.2
N$1
  Top 0.254: Q-NAND.1 Q-NAND.2 73.05,6.35 73.2,6.5 73.2,7.39 72.95,7.65 Q-NAND.4
N$2
  Top 0.254: R16.1 11.51,15.36 R17.2 BOOST.4
N$8
  Top 0.254: R20.2 51.74,2.84 53.19,4.29 53.93,4.29 Q3.B
N$14  (via drill 0.35)
  Top 0.254: 66.16,6.32 Q-NAND.13 Q-NAND.12 66.13,6.98 65.18,6.98 65,7.16 | R12.1 65.02,8.66 65.38,8.31 66.13,8.31 Q-NAND.10 65.34,8.3 65,7.95 65,7.16 | Q3.C v58.47,3.35 | v58.47,3.35 58.5,3.35 v58.47,3.35 | 65,7.16 64.29,7.87 v62.89,7.87
  Bottom 0.254: v62.89,7.87 62.89,7.77 v58.47,3.35
N$15
  Top 0.254: DC-IN-SW.6 51.61,15.9 51.61,17.5 R14.1
N$16
  Top 0.254: Q1.1 52.76,21.84 50.7,21.84 R9.1
N$17
  Top 0.254: LIPO-SW.6 56.64,15.9 56.64,17.5 R15.1
N$19
  Top 0.254: 55.04,20.93 Q1.3 55.45,20.83 56.69,22.07 56.69,23.1 R10.2
N$24
  Top 0.254: PUSH-ON/OFF.3 62.81,11.42 R12.2 C4.1
  Bottom 0.254: PUSH-ON/OFF.4 PUSH-ON/OFF.3
N$25  (via drill 0.33)
  Top 0.254: Q-NAND.8 Q-NAND.9 68.65,8.95 v69.04,8.56 69.09,8.51 | R11.2 75.96,5.8 PUSH-ON/OFF.2
  Bottom 0.254: 68.99,5.16 PUSH-ON/OFF.2 | 68.99,5.16 PUSH-ON/OFF.1 | v69.04,8.56 69.04,5.2 68.99,5.16
ON/OFF
  Top 0.254: Q-NAND.3 70.85,7 67.08,3.23 61.29,3.23 57.56,6.96 57.56,9.98 57.33,10.21 55.83,10.21 54.64,11.4 54.64,14.5 | LIPO-SW.5 57.58,14.91 57.18,14.5 54.64,14.5 | 54.64,14.5 52.86,14.5 52.48,14.88 52.48,15.8 DC-IN-SW.5 | 54.64,14.5
RX  (1 unrouted)
SCL  (3 unrouted)
  Top 0.254: 30.91,23.88 33.33,21.46 35.1,21.46 35.61,20.95 35.61,20.02 I2C-TVS.3 35.62,18.4 32.97,15.75 FRAM.6 | R6.1 37.93,27.86 32.23,27.86
  Bottom 0.254: JP2.4 39.93,32.38 36.58,29.03 33.4,29.03
SCL1  (3 unrouted)
  Top 0.254: 25.55,20.24 I2C1-TVS.3 26.14,20.17 27.18,21.21 27.18,23.62 25.83,24.97
  Bottom 0.254: JP3.5 21.82,30.56
SDA  (3 unrouted)
  Top 0.254: 28.5,26.42 28.5,25.27 33.61,20.16 I2C-TVS.1 33.83,20.05 33.83,18.16 32.69,17.02 FRAM.5 | 29.75,27.92 29.76,27.91 31.32,27.91 32.46,29.06 36.06,29.06 R5.1
  Bottom 0.254: JP2.5 37.08,33.68 31.32,27.91 29.74,27.91
SDA1  (3 unrouted)
  Top 0.254: I2C1-TVS.1 23.62,20.17 23.62,21.11 23.95,21.44 25.91,21.44 26.42,21.95 26.42,23.42
  Bottom 0.254: JP3.4 19.28,30.56
SW
  Top 0.508: 16.95,20.32 L1.P$2 | 16.95,20.32 16.71,20.32 | 16.95,20.32 16.04,21.23 13.64,21.23 13.41,21.01 BOOST.1
TEMP  (1 unrouted)
  Top 0.254: TEMP.1 27.77,15.33 28.52,14.58 28.52,8.92
TX  (1 unrouted)
USER-SW  (via drill 0.35)
  Top 0.254: R4.1 46.32,29.03 v48.72,29.03 50.98,29.03 S1.1
  Bottom 0.254: 41.12,26.54 42.44,27.86 47.52,27.86 48.69,29.03 v48.72,29.03 | S1.1 S1.2
VCC  (via drill 0.35)  (1 unrouted)
  Top 0.254: 31.72,13.16 FRAM.8 | 41.05,23.62 39.85,24.82 39.85,27.2 41.07,28.42 42.34,27.15 42.34,24.72 41.15,23.52 | R3.2 43.05,22.78 42.47,22.2 | BOOST.3 v10.69,19.86 10.62,19.86
  Top 0.508: 46.34,30.84 41.09,30.84 | 46.34,30.84 54.05,30.84 54.89,29.92 54.89,27.97 | 41.09,30.84 R6.2 R5.2 32.15,30.84 F2.1 32.07,30.82 | JP1.2 43.31,21.36 42.47,22.2 41.57,23.1 | 41.57,23.1 41.15,23.52 | 41.07,28.42 41.07,30.6 41.09,30.84 | 41.57,23.1 34.57,16.09 34.57,14.76 33.02,13.21 FRAM.8 29.78,13.21 C1.1 29.74,17.14 29.16,17.73 27.85,17.73 C2.1 27.45,17.72 26.82,17.09 | R4.2 46.33,30.82 46.34,30.84 | J1.2 10.44,6.73 10.44,9.19 11.76,10.52 14.78,10.52 v14.78,16.05 14.78,17.26 C9.1 | TEMP.2 26.81,15.71 26.82,15.73 26.82,17.09 | 21.76,17.09 26.82,17.09 | 20.71,17.09 21.76,17.09 | 20.71,17.09 20.27,17.09 20.22,17.14 | SJ1.3 10.08,26.39 11.79,24.69 18.77,24.69 21.74,21.72 21.74,17.12 21.76,17.09 | BOOST.6 13.87,17.27 14.07,17.48 15,17.48 C9.1 | C9.1 15.43,17.54 15.95,17.02 L1.P$1 20.63,17.02 20.71,17.09
  Bottom 0.254: v10.69,19.86 11.1,19.86 14.81,16.15 14.81,16.08 v14.78,16.05
  Bottom 0.508: J2.2 23.72,3.05 19.79,7.01 13.51,7.01 12.7,6.19 12.7,5.01 14.1,3.61 J1.2
VCC1-EXT
  Top 0.508: F3.2 24.69,33.35 JP3.6
  Top 0.813: V2.2 29.57,30.99 F3.2
VCC-EXT
  Top 0.508: F2.2 34.8,33.38 JP2.6
  Top 0.813: V3.2 31.71,33.19 F2.2
VDD
  Top 0.508: JP1.1 43.31,16.47 WATCHDOG.1
VIN  (1 unrouted)
  Top 0.254: 52.53,13.16 DC-IN-SW.2 | 53.44,13.16 DC-IN-SW.3 | 53.44,11.33 C6.1
  Top 0.508: C6.1 53.4,10.81 54.05,10.16 54.91,10.16 | 53.44,11.33 DC-IN-SW.3 DC-IN-SW.2
VSELECT
  Top 0.508: SJ1.2 17.09,29.74 18.16,30.81 19.93,30.81 R7.2 R8.2 27.06,30.82 F3.1
WKP  (1 unrouted)
  Top 0.254: WATCHDOG.5 42.37,12.55

### Text on the board
tNames: 5V / VSel / 3.3V
bNames: Vcc SCLSDA C3 C2 GND | GND D3 D2 SCL SDA Vcc | v2.1 - 8-3-17 | chip@seeinsights.com | + | + | B3 B2 B1 | A3 A2 A1 | GND B4 Vcc | GND A4 Vcc | Tx Rx